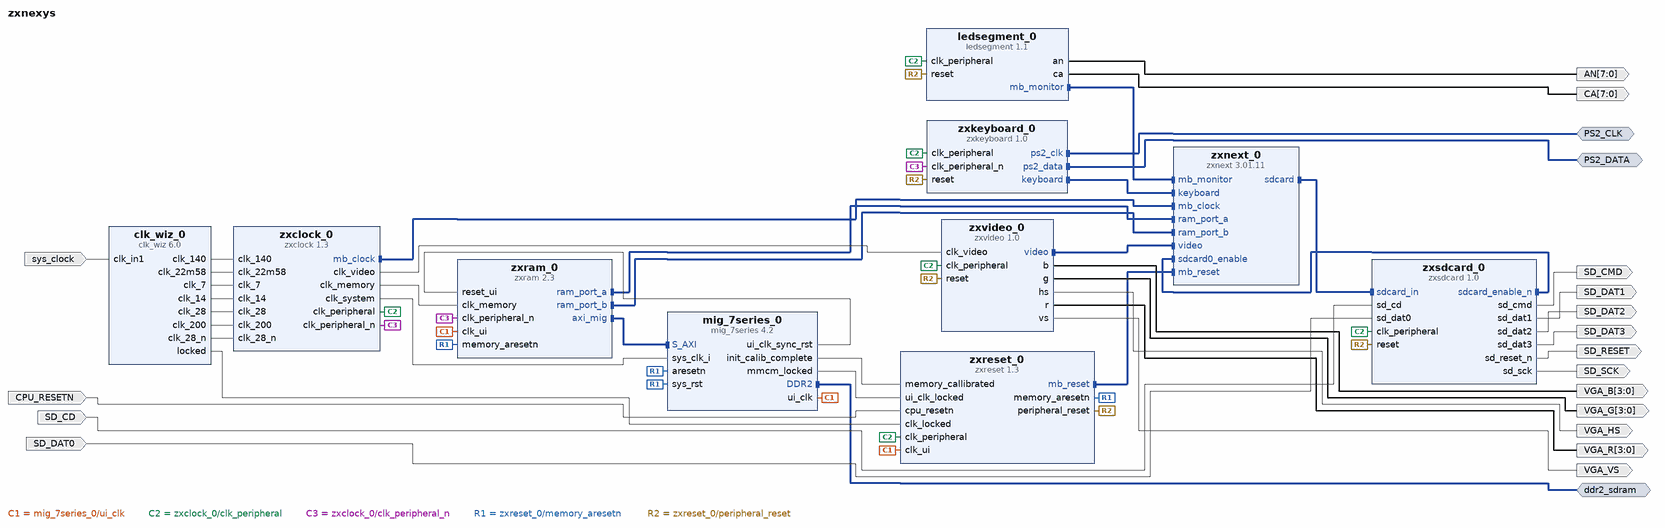
[diagram p0: block diagram of the top level]
# Vivado block design zxnexys, xc7a100tcsg324-1, Vivado 2021.2
create_bd_design zxnexys

create_bd_intf_port -mode Master -vlnv xilinx.com:interface:gpio_rtl:1.0 PS2_CLK
create_bd_intf_port -mode Master -vlnv xilinx.com:interface:gpio_rtl:1.0 PS2_DATA
create_bd_intf_port -mode Master -vlnv xilinx.com:interface:ddrx_rtl:1.0 ddr2_sdram
create_bd_port -dir I -type clk sys_clock
set_property -dict {CONFIG.FREQ_HZ 100000000 CONFIG.PHASE 0.0} [get_bd_ports sys_clock]
create_bd_port -dir I CPU_RESETN
create_bd_port -dir O -from 3 -to 0 VGA_B
create_bd_port -dir O -from 3 -to 0 VGA_G
create_bd_port -dir O VGA_HS
create_bd_port -dir O -from 3 -to 0 VGA_R
create_bd_port -dir O VGA_VS
create_bd_port -dir O -from 7 -to 0 AN
create_bd_port -dir O -from 7 -to 0 CA
create_bd_port -dir I SD_CD
create_bd_port -dir O SD_CMD
create_bd_port -dir I SD_DAT0
create_bd_port -dir O SD_DAT1
create_bd_port -dir O SD_DAT2
create_bd_port -dir O SD_DAT3
create_bd_port -dir O SD_RESET
create_bd_port -dir O SD_SCK

create_bd_cell -type ip -vlnv specnext.com:specnext:zxvideo:1.0 zxvideo_0
create_bd_cell -type ip -vlnv specnext.com:specnext:zxsdcard:1.0 zxsdcard_0
create_bd_cell -type ip -vlnv specnext.com:specnext:ledsegment:1.1 ledsegment_0
create_bd_cell -type ip -vlnv specnext.com:specnext:zxnext:3.01.11 zxnext_0
create_bd_cell -type ip -vlnv specnext.com:specnext:zxkeyboard:1.0 zxkeyboard_0
create_bd_cell -type ip -vlnv xilinx.com:ip:clk_wiz:6.0 clk_wiz_0
set_property -dict [list \
  CONFIG.CLKOUT1_JITTER 130.488 \
  CONFIG.CLKOUT1_PHASE_ERROR 122.577 \
  CONFIG.CLKOUT1_REQUESTED_OUT_FREQ 200 \
  CONFIG.CLKOUT2_DRIVES No_buffer \
  CONFIG.CLKOUT2_JITTER 139.537 \
  CONFIG.CLKOUT2_PHASE_ERROR 122.577 \
  CONFIG.CLKOUT2_REQUESTED_OUT_FREQ 140 \
  CONFIG.CLKOUT2_USED true \
  CONFIG.CLKOUT3_DRIVES No_buffer \
  CONFIG.CLKOUT3_JITTER 193.383 \
  CONFIG.CLKOUT3_PHASE_ERROR 122.577 \
  CONFIG.CLKOUT3_REQUESTED_OUT_FREQ 28 \
  CONFIG.CLKOUT3_REQUESTED_PHASE 180 \
  CONFIG.CLKOUT3_USED true \
  CONFIG.CLKOUT4_DRIVES No_buffer \
  CONFIG.CLKOUT4_JITTER 193.383 \
  CONFIG.CLKOUT4_PHASE_ERROR 122.577 \
  CONFIG.CLKOUT4_REQUESTED_OUT_FREQ 28 \
  CONFIG.CLKOUT4_USED true \
  CONFIG.CLKOUT5_DRIVES No_buffer \
  CONFIG.CLKOUT5_JITTER 201.826 \
  CONFIG.CLKOUT5_PHASE_ERROR 122.577 \
  CONFIG.CLKOUT5_REQUESTED_OUT_FREQ 22.58065 \
  CONFIG.CLKOUT5_USED true \
  CONFIG.CLKOUT6_DRIVES No_buffer \
  CONFIG.CLKOUT6_JITTER 221.798 \
  CONFIG.CLKOUT6_PHASE_ERROR 122.577 \
  CONFIG.CLKOUT6_REQUESTED_OUT_FREQ 14 \
  CONFIG.CLKOUT6_USED true \
  CONFIG.CLKOUT7_DRIVES No_buffer \
  CONFIG.CLKOUT7_JITTER 253.969 \
  CONFIG.CLKOUT7_PHASE_ERROR 122.577 \
  CONFIG.CLKOUT7_REQUESTED_OUT_FREQ 7 \
  CONFIG.CLKOUT7_USED true \
  CONFIG.CLK_IN1_BOARD_INTERFACE sys_clock \
  CONFIG.CLK_OUT1_PORT clk_200 \
  CONFIG.CLK_OUT2_PORT clk_140 \
  CONFIG.CLK_OUT3_PORT clk_28_n \
  CONFIG.CLK_OUT4_PORT clk_28 \
  CONFIG.CLK_OUT5_PORT clk_22m58 \
  CONFIG.CLK_OUT6_PORT clk_14 \
  CONFIG.CLK_OUT7_PORT clk_7 \
  CONFIG.MMCM_CLKFBOUT_MULT_F 7.000 \
  CONFIG.MMCM_CLKOUT0_DIVIDE_F 3.500 \
  CONFIG.MMCM_CLKOUT1_DIVIDE 5 \
  CONFIG.MMCM_CLKOUT2_DIVIDE 25 \
  CONFIG.MMCM_CLKOUT2_PHASE 180.000 \
  CONFIG.MMCM_CLKOUT3_DIVIDE 25 \
  CONFIG.MMCM_CLKOUT4_DIVIDE 31 \
  CONFIG.MMCM_CLKOUT5_DIVIDE 50 \
  CONFIG.MMCM_CLKOUT6_DIVIDE 100 \
  CONFIG.NUM_OUT_CLKS 7 \
  CONFIG.USE_BOARD_FLOW true \
  CONFIG.USE_RESET false \
] [get_bd_cells clk_wiz_0]
create_bd_cell -type ip -vlnv specnext.com:specnext:zxclock:1.3 zxclock_0
create_bd_cell -type ip -vlnv specnext.com:specnext:zxreset:1.3 zxreset_0
create_bd_cell -type ip -vlnv xilinx.com:ip:mig_7series:4.2 mig_7series_0
set_property -dict [list \
  CONFIG.BOARD_MIG_PARAM ddr2_sdram \
  CONFIG.RESET_BOARD_INTERFACE Custom \
  CONFIG.XML_INPUT_FILE mig_a.prj \
] [get_bd_cells mig_7series_0]
create_bd_cell -type ip -vlnv specnext.com:specnext:zxram:2.3 zxram_0

# ---- connections ----

connect_bd_intf_net [get_bd_intf_ports ddr2_sdram] [get_bd_intf_pins mig_7series_0/DDR2]
connect_bd_intf_net [get_bd_intf_pins zxclock_0/mb_clock] [get_bd_intf_pins zxnext_0/mb_clock]
connect_bd_intf_net [get_bd_intf_ports PS2_CLK] [get_bd_intf_pins zxkeyboard_0/ps2_clk]
connect_bd_intf_net [get_bd_intf_ports PS2_DATA] [get_bd_intf_pins zxkeyboard_0/ps2_data]
connect_bd_intf_net [get_bd_intf_pins zxkeyboard_0/keyboard] [get_bd_intf_pins zxnext_0/keyboard]
connect_bd_intf_net [get_bd_intf_pins ledsegment_0/mb_monitor] [get_bd_intf_pins zxnext_0/mb_monitor]
connect_bd_intf_net [get_bd_intf_pins zxram_0/ram_port_a] [get_bd_intf_pins zxnext_0/ram_port_a]
connect_bd_intf_net [get_bd_intf_pins zxram_0/ram_port_b] [get_bd_intf_pins zxnext_0/ram_port_b]
connect_bd_intf_net [get_bd_intf_pins zxsdcard_0/sdcard_in] [get_bd_intf_pins zxnext_0/sdcard]
connect_bd_intf_net [get_bd_intf_pins zxsdcard_0/sdcard_enable_n] [get_bd_intf_pins zxnext_0/sdcard0_enable]
connect_bd_intf_net [get_bd_intf_pins zxvideo_0/video] [get_bd_intf_pins zxnext_0/video]
connect_bd_intf_net [get_bd_intf_pins zxram_0/axi_mig] [get_bd_intf_pins mig_7series_0/S_AXI]
connect_bd_intf_net [get_bd_intf_pins zxreset_0/mb_reset] [get_bd_intf_pins zxnext_0/mb_reset]
connect_bd_net -net SYS_RESET_N_1 [get_bd_ports CPU_RESETN] [get_bd_pins zxreset_0/cpu_resetn]
connect_bd_net [get_bd_pins clk_wiz_0/clk_140] [get_bd_pins zxclock_0/clk_140]
connect_bd_net [get_bd_pins clk_wiz_0/clk_22m58] [get_bd_pins zxclock_0/clk_22m58]
connect_bd_net [get_bd_pins clk_wiz_0/clk_7] [get_bd_pins zxclock_0/clk_7]
connect_bd_net [get_bd_pins clk_wiz_0/clk_14] [get_bd_pins zxclock_0/clk_14]
connect_bd_net [get_bd_pins clk_wiz_0/clk_28] [get_bd_pins zxclock_0/clk_28]
connect_bd_net [get_bd_pins clk_wiz_0/clk_200] [get_bd_pins zxclock_0/clk_200]
connect_bd_net [get_bd_pins clk_wiz_0/clk_28_n] [get_bd_pins zxclock_0/clk_28_n]
connect_bd_net [get_bd_pins clk_wiz_0/locked] [get_bd_pins zxreset_0/clk_locked]
connect_bd_net [get_bd_pins ledsegment_0/an] [get_bd_ports AN]
connect_bd_net [get_bd_pins ledsegment_0/ca] [get_bd_ports CA]
connect_bd_net [get_bd_pins mig_7series_0/init_calib_complete] [get_bd_pins zxreset_0/memory_callibrated]
connect_bd_net [get_bd_pins mig_7series_0/mmcm_locked] [get_bd_pins zxreset_0/ui_clk_locked]
connect_bd_net [get_bd_pins mig_7series_0/ui_clk] [get_bd_pins zxreset_0/clk_ui] [get_bd_pins zxram_0/clk_ui]
connect_bd_net [get_bd_pins mig_7series_0/ui_clk_sync_rst] [get_bd_pins zxram_0/reset_ui]
connect_bd_net -net sd_cd_0_1 [get_bd_ports SD_CD] [get_bd_pins zxsdcard_0/sd_cd]
connect_bd_net -net sd_dat0_0_1 [get_bd_ports SD_DAT0] [get_bd_pins zxsdcard_0/sd_dat0]
connect_bd_net [get_bd_ports sys_clock] [get_bd_pins clk_wiz_0/clk_in1]
connect_bd_net [get_bd_pins zxclock_0/clk_memory] [get_bd_pins zxram_0/clk_memory]
connect_bd_net [get_bd_pins zxclock_0/clk_peripheral] \
  [get_bd_pins ledsegment_0/clk_peripheral] [get_bd_pins zxkeyboard_0/clk_peripheral] [get_bd_pins zxsdcard_0/clk_peripheral] \
  [get_bd_pins zxvideo_0/clk_peripheral] [get_bd_pins zxreset_0/clk_peripheral]
connect_bd_net [get_bd_pins zxclock_0/clk_peripheral_n] [get_bd_pins zxkeyboard_0/clk_peripheral_n] [get_bd_pins zxram_0/clk_peripheral_n]
connect_bd_net [get_bd_pins zxclock_0/clk_system] [get_bd_pins mig_7series_0/sys_clk_i]
connect_bd_net [get_bd_pins zxclock_0/clk_video] [get_bd_pins zxvideo_0/clk_video]
connect_bd_net [get_bd_pins zxreset_0/memory_aresetn] \
  [get_bd_pins mig_7series_0/aresetn] [get_bd_pins mig_7series_0/sys_rst] [get_bd_pins zxram_0/memory_aresetn]
connect_bd_net -net zxreset_0_reset_peripheral [get_bd_pins zxreset_0/peripheral_reset] \
  [get_bd_pins ledsegment_0/reset] [get_bd_pins zxkeyboard_0/reset] [get_bd_pins zxsdcard_0/reset] \
  [get_bd_pins zxvideo_0/reset]
connect_bd_net [get_bd_pins zxsdcard_0/sd_cmd] [get_bd_ports SD_CMD]
connect_bd_net [get_bd_pins zxsdcard_0/sd_dat1] [get_bd_ports SD_DAT1]
connect_bd_net [get_bd_pins zxsdcard_0/sd_dat2] [get_bd_ports SD_DAT2]
connect_bd_net [get_bd_pins zxsdcard_0/sd_dat3] [get_bd_ports SD_DAT3]
connect_bd_net [get_bd_pins zxsdcard_0/sd_reset_n] [get_bd_ports SD_RESET]
connect_bd_net [get_bd_pins zxsdcard_0/sd_sck] [get_bd_ports SD_SCK]
connect_bd_net [get_bd_pins zxvideo_0/b] [get_bd_ports VGA_B]
connect_bd_net [get_bd_pins zxvideo_0/g] [get_bd_ports VGA_G]
connect_bd_net [get_bd_pins zxvideo_0/hs] [get_bd_ports VGA_HS]
connect_bd_net [get_bd_pins zxvideo_0/r] [get_bd_ports VGA_R]
connect_bd_net [get_bd_pins zxvideo_0/vs] [get_bd_ports VGA_VS]

# ---- address map ----
assign_bd_address -offset 0x0000000 -range 128M -target_address_space [get_bd_addr_spaces zxram_0/axi_mig] [get_bd_addr_segs mig_7series_0/memmap/memaddr]

validate_bd_design
save_bd_design
